# Altium project PCB_dron.PrjPcb
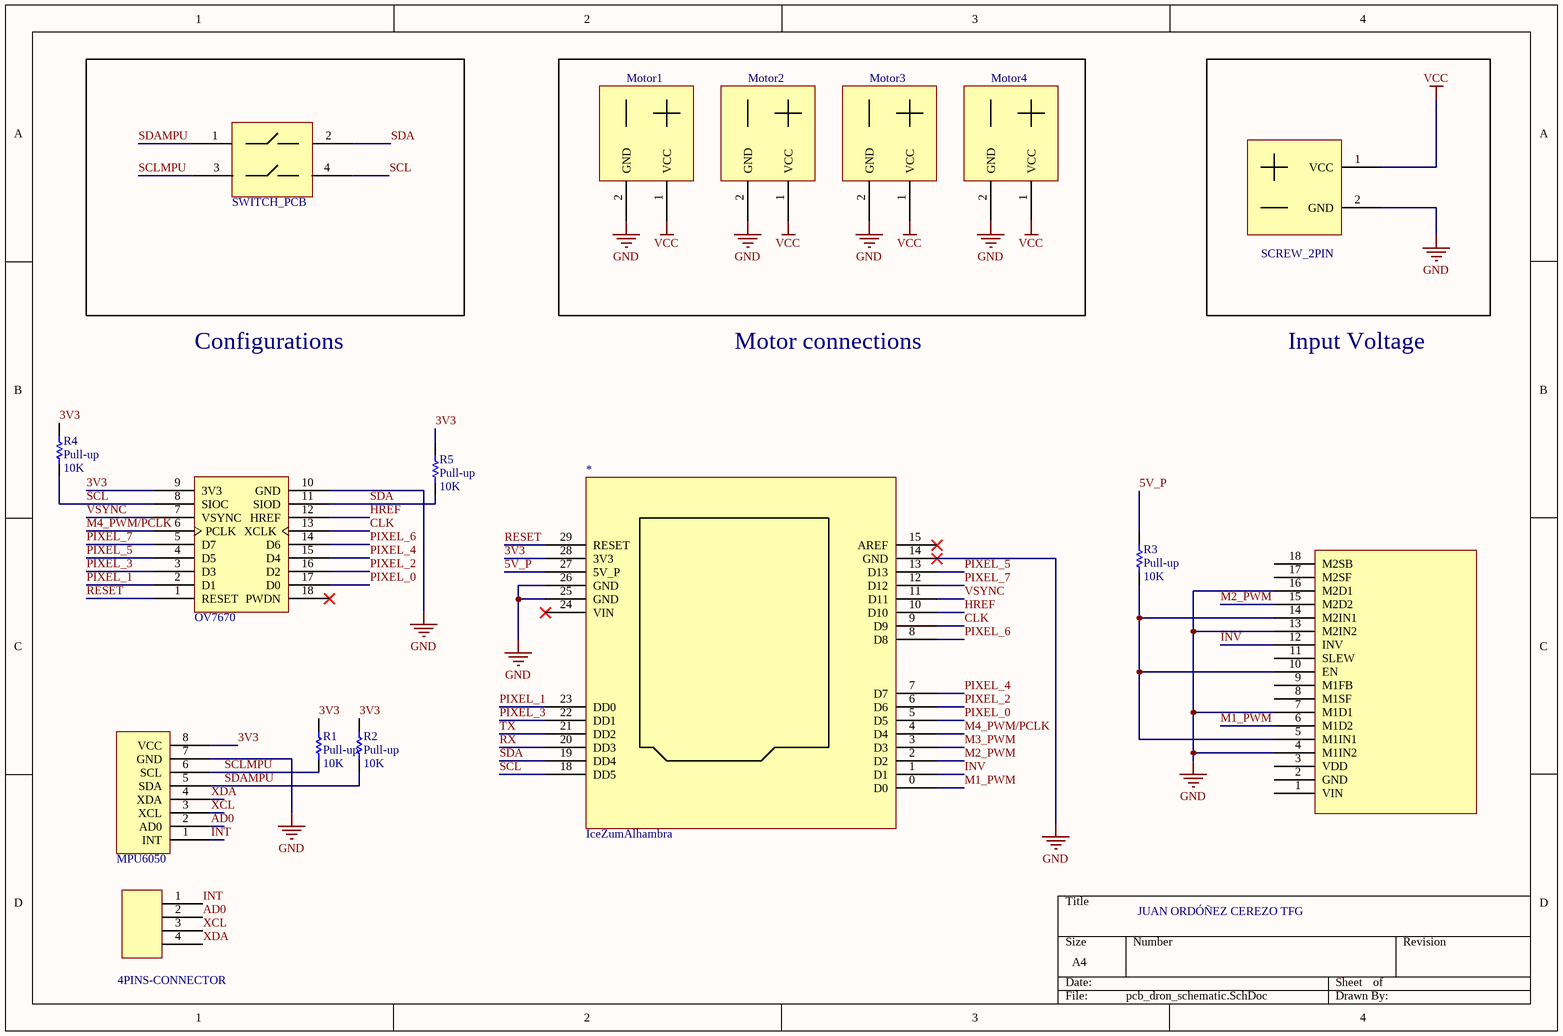
[diagram p0: pcb_dron_schematic.SchDoc]
1 sheet, 16 parts. Net scope: global (net labels, ports and power ports of the same name join across sheets).
Board file: pdb_tfg.PcbDoc

## Sheet pcb_dron_schematic.SchDoc
size A4

### Parts
(Parts that share a designator on the sheet are numbered #1, #2 ... from top to bottom, then left to right.)
*#1  SWITCH_PCB  [SWITCH_PCB]  (part B of 2)
*#2  OV7670  [OV7670]
*#3  IceZumAlhambra  [IceZumAlhambra]
*#4  MC33926  [MC33926]  (value not drawn)
*#5  MPU6050  [MPU6050]  (part B of 2)
*#6  4PINS-CONNECTOR  [4PINS]
LIPO_INPUT  SCREW_2PIN  [SCREW_2PIN]
Motor1  SCREW_2PIN  [SCREW_2PIN]  (value not drawn)
Motor2  SCREW_2PIN  [SCREW_2PIN]  (value not drawn)
Motor3  SCREW_2PIN  [SCREW_2PIN]  (value not drawn)
Motor4  SCREW_2PIN  [SCREW_2PIN]  (value not drawn)
R1  Pull-up  value 10K  [AXIAL-0.3]
R2  Pull-up  value 10K  [AXIAL-0.3]
R3  Pull-up  value 10K  [AXIAL-0.3]
R4  Pull-up  value 10K  [AXIAL-0.3]
R5  Pull-up  value 10K  [AXIAL-0.3]

### Nets
GND: *#2.10(GND) *#3.14(GND) *#3.25(GND) *#3.26(GND) *#4.4(M1IN2) *#4.7(M1D1) *#4.13(M2IN2) *#4.16(M2D1) *#5.7(GND) LIPO_INPUT.2(GND) Motor1.2(GND) Motor2.2(GND) Motor3.2(GND) Motor4.2(GND)
VCC: LIPO_INPUT.1(VCC) Motor1.1(VCC) Motor2.1(VCC) Motor3.1(VCC) Motor4.1(VCC)
3V3: *#2.9(3V3) *#3.28(3V3) *#5.8(VCC) R1.2 R2.2 R4.2 R5.2
5V_P: *#3.27(5V_P) R3.2
AD0: *#5.2(AD0) *#6.2
CLK: *#2.13(XCLK) *#3.9(D9)
HREF: *#2.12(HREF) *#3.10(D10)
INT: *#5.1(INT) *#6.1
INV: *#3.1(D1) *#4.12(INV)
M1_PWM: *#3.0(D0) *#4.6(M1D2)
M2_PWM: *#3.2(D2) *#4.15(M2D2)
M3_PWM: *#3.3(D3)
M4_PWM/PCLK: *#2.6(PCLK) *#3.4(D4)
PIXEL_0: *#2.17(D0) *#3.5(D5)
PIXEL_1: *#2.2(D1) *#3.23(DD0)
PIXEL_2: *#2.16(D2) *#3.6(D6)
PIXEL_3: *#2.3(D3) *#3.22(DD1)
PIXEL_4: *#2.15(D4) *#3.7(D7)
PIXEL_5: *#2.4(D5) *#3.13(D13)
PIXEL_6: *#2.14(D6) *#3.8(D8)
PIXEL_7: *#2.5(D7) *#3.12(D12)
RESET: *#2.1(RESET) *#3.29(RESET)
RX: *#3.20(DD3)
SCL: *#1.4 *#2.8(SIOC) *#3.18(DD5) R4.1
SCLMPU: *#1.3 *#5.6(SCL) R1.1
SDA: *#1.2(P1) *#2.11(SIOD) *#3.19(DD4) R5.1
SDAMPU: *#1.1(P1) *#5.5(SDA) R2.1
TX: *#3.21(DD2)
VSYNC: *#2.7(VSYNC) *#3.11(D11)
XCL: *#5.3(XCL) *#6.3
XDA: *#5.4(XDA) *#6.4
Net*#4_5: *#4.5(M1IN1) *#4.10(EN) *#4.14(M2IN1) R3.1

Not connected (* = marked no-connect by the designer): *#2 18(PWDN)*; *#3 15(AREF)* 24(VIN)*; *#4 1(VIN) 2(GND) 3(VDD) 8(M1SF) 9(M1FB) 11(SLEW) 17(M2SF) 18(M2SB)

### Notes on the sheet
- Configurations
- Motor connections
- Input Voltage
- JUAN ORDÓÑEZ CEREZO TFG

### Library data of the parts
*#6 = 4PINS
R1-R5 = Res1: Resistor; Published: 8-Jun-2000; LatestRevisionDate: 17-Jul-2002; LatestRevisionNote: Re-released for DXP Platform.; PackageReference: AXIAL-0.3; Publisher: Altium Limited; PackageDescription: Axial Device, Thru-Hole; 2 Leads; 0.3 in Pin Spacing